# EAGLE design MAPE-CUN-Large-022-Input (EAGLE 7.3.0)
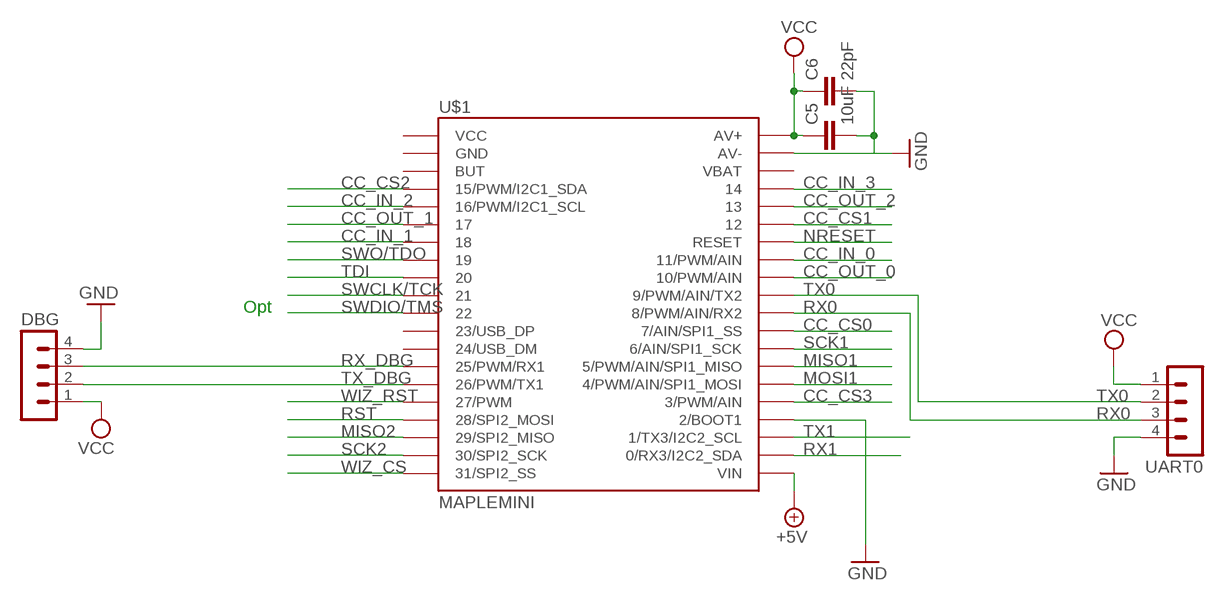
[diagram p0: schematic, sheet 1]

## Parts
C5  10uF  C-EUC1210  [C1210]
C6  22pF  C-EUC0805  [C0805]
DBG  MA04-1  [MA04-1]
U$1  MAPLEMINI  [20-DIP]
UART0  MA04-1  [MA04-1]

## Nets
+5V: U$1.21(VIN)
CC_CS0: U$1.29(7/AIN/SPI1_SS)
CC_CS1: U$1.35
CC_CS2: U$1.4(15/PWM/I2C1_SDA)
CC_CS3: U$1.25(3/PWM/AIN)
CC_IN_0: U$1.33(11/PWM/AIN)
CC_IN_1: U$1.7
CC_IN_2: U$1.5(16/PWM/I2C1_SCL)
CC_IN_3: U$1.37
CC_OUT_0: U$1.32(10/PWM/AIN)
CC_OUT_1: U$1.6
CC_OUT_2: U$1.36
GND: C5.2 C6.2 DBG.4 U$1.24(2/BOOT1) U$1.39(AV-) UART0.4
MISO1: U$1.27(5/PWM/AIN/SPI1_MISO)
MISO2: U$1.18(29/SPI2_MISO)
MOSI1: U$1.26(4/PWM/AIN/SPI1_MOSI)
NRESET: U$1.34(RESET)
RST: U$1.17(28/SPI2_MOSI)
RX0: U$1.30(8/PWM/AIN/RX2) UART0.3
RX1: U$1.22(0/RX3/I2C2_SDA)
RX_DBG: DBG.3 U$1.14(25/PWM/RX1)
SCK1: U$1.28(6/AIN/SPI1_SCK)
SCK2: U$1.19(30/SPI2_SCK)
SWCLK/TCK: U$1.10
SWDIO/TMS: U$1.11
SWO/TDO: U$1.8
TDI: U$1.9
TX0: U$1.31(9/PWM/AIN/TX2) UART0.2
TX1: U$1.23(1/TX3/I2C2_SCL)
TX_DBG: DBG.2 U$1.15(26/PWM/TX1)
VCC: C5.1 C6.1 DBG.1 U$1.40(AV+) UART0.1
WIZ_CS: U$1.20(31/SPI2_SS)
WIZ_RST: U$1.16(27/PWM)
Unconnected: U$1.1(VCC) U$1.2(GND) U$1.3(BUT) U$1.12(23/USB_DP) U$1.13(24/USB_DM) U$1.38(VBAT)

## Notes on the sheet
- Opt

## Library data of the parts
C5 C6 = rcl:C-EU: CAPACITOR, European symbol
DBG UART0 = con-lstb:MA04-1: PIN HEADER; OC_FARNELL: unknown; OC_NEWARK: unknown
U$1 = maplemini-small:MAPLEMINI

## Net classes
0 default: width 0.406 mm
1 PWR: width 0.305 mm

## Board
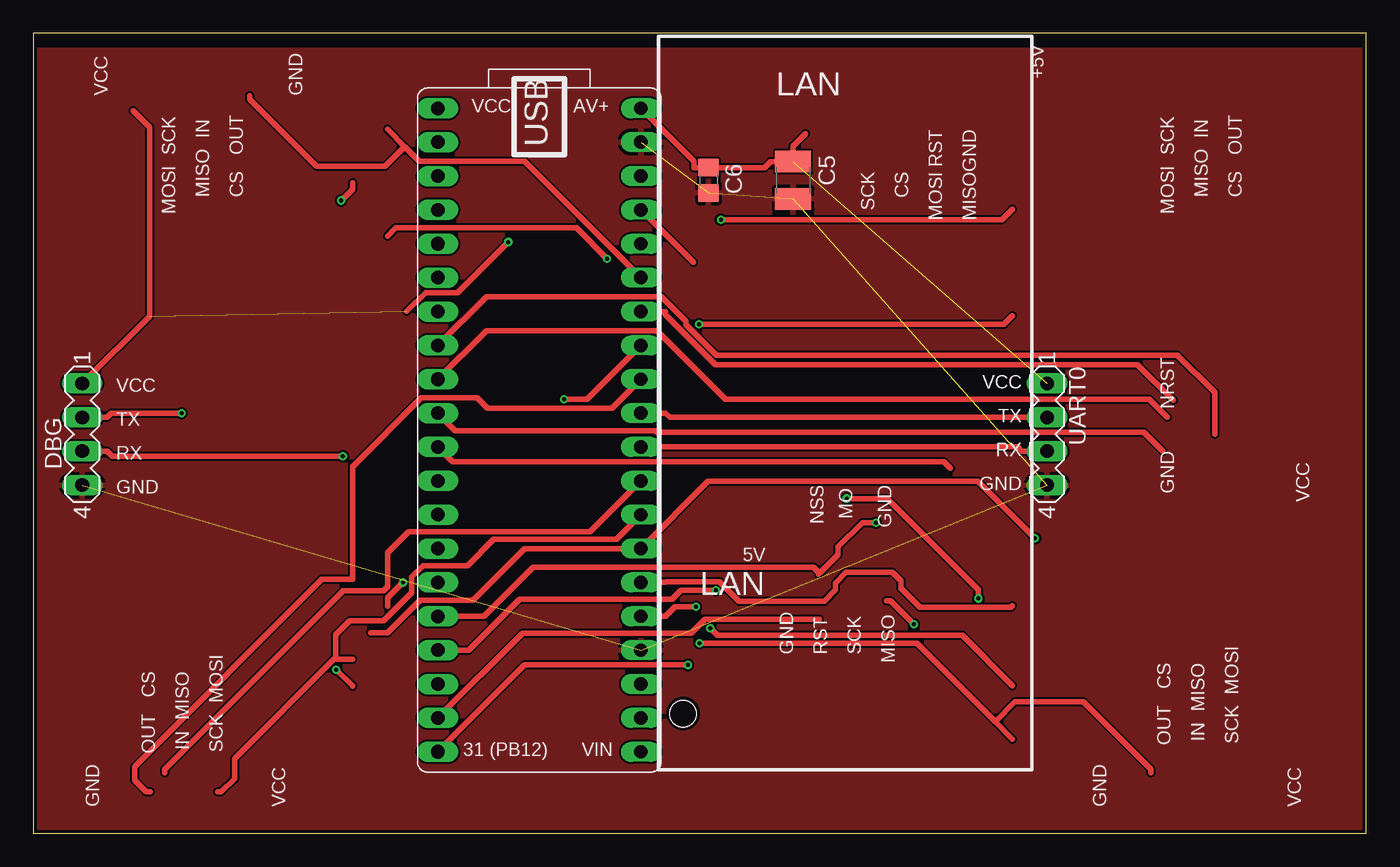
[diagram p1: board, top side]
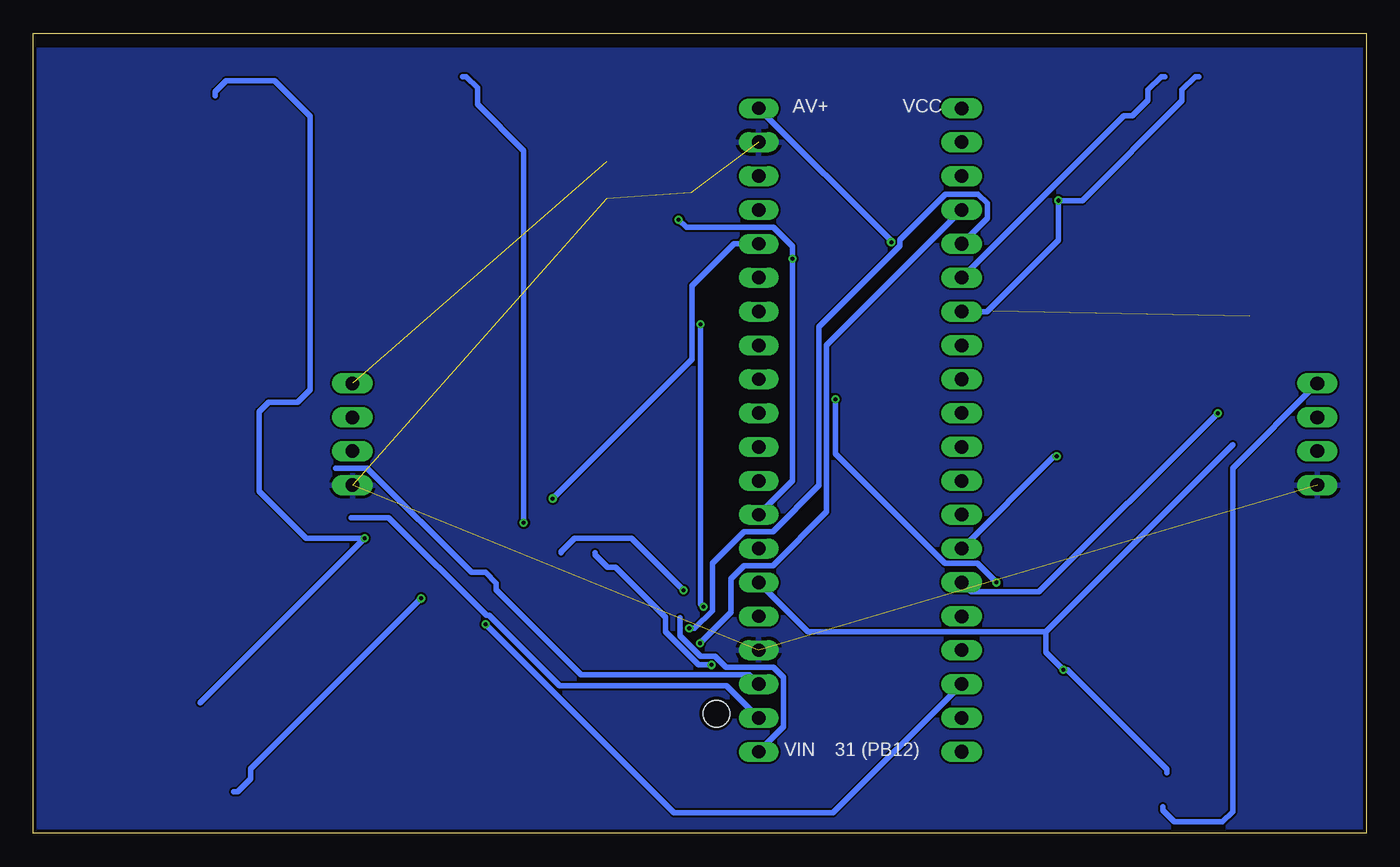
[diagram p2: board, bottom side, seen from below]

Size 100 x 60 mm. Coordinates in mm from the lower left corner, seen from the top.
Outline: 0,60 0,0 100,0 100,60 0,60
Copper layers (1*16): Top 0.035mm / dielectric 1.5mm / Bottom 0.035mm
Design rules "SeeedStudio_2layer_DRU_no_angle_20140221": minimum track width 6mil, minimum drill 12mil, track to track 6mil, track to pad 6mil, pad to pad 6mil, via to via 6mil, smd to smd 0mil, copper to edge 10mil, drill to drill 10mil, minimum pad ring 10mil, minimum via ring 6mil, stop-mask expansion 2mil, vias tented up to drill 100mil, thermal gap 10mil
Holes 2 mm at 48.76,8.97
tRestrict: area -0.1,59.1 to 100.2,59.8
bRestrict: area -0.1,59.1 to 100.2,59.8

### Footprints (pad centres in the part's own frame; a part is rotated, then mirrored left to right if it is on the bottom)
C1210 = smd 1.6 x 2.7: 1 -1.4,0; 2 1.4,0
C0805 = smd 1.3 x 1.5: 1 -0.95,0; 2 0.95,0
MA04-1 = drill 1.016 long: 1 -3.81,0; 2 -1.27,0; 3 1.27,0; 4 3.81,0
20-DIP = drill 1.016 pad 1.27 long: 1 -24.13,-7.62; 2 -21.59,-7.62; 3 -19.05,-7.62; 4 -16.51,-7.62; 5 -13.97,-7.62; 6 -11.43,-7.62; 7 -8.89,-7.62; 8 -6.35,-7.62; 9 -3.81,-7.62; 10 -1.27,-7.62; 11 1.27,-7.62; 12 3.81,-7.62; 13 6.35,-7.62; 14 8.89,-7.62; 15 11.43,-7.62; 16 13.97,-7.62; 17 16.51,-7.62; 18 19.05,-7.62; 19 21.59,-7.62; 20 24.13,-7.62 | drill 1 pad 1.27 long: 21 24.13,7.62; 22 21.59,7.62; 23 19.05,7.62; 24 16.51,7.62; 25 13.97,7.62; 26 11.43,7.62; 27 8.89,7.62; 28 6.35,7.62; 29 3.81,7.62; 30 1.27,7.62; 31 -1.27,7.62; 32 -3.81,7.62; 33 -6.35,7.62; 34 -8.89,7.62; 35 -11.43,7.62; 36 -13.97,7.62; 37 -16.51,7.62; 38 -19.05,7.62; 39 -21.59,7.62; 40 -24.13,7.62

### Placement (x,y rotation side)
C5  57.01,48.98 270 top
C6  50.66,48.98 270 top
DBG  3.67,29.93 270 top
U$1  37.96,30.25 270 top
UART0  76.06,29.93 270 top

### Tracks (layer width: path | path; a pad name or v marks a point on that pad's centre or on a via)
+5V
  Bottom 0.406: 51.48,16.15 51.48,14.83 49.95,13.29 48.84,13.29 48.02,12.47 44.46,12.47 43.71,11.71 43.71,7.99 U$1.21
CC_CS0
  Top 0.406: 9.87,4.53 9.87,4.81 23.26,18.2 26.29,18.2 26.58,18.49 26.58,21.04 28.17,22.63 41.77,22.63 U$1.29
CC_CS1
  Top 0.406: 27.86,51.51 26.58,52.79 | U$1.35 36.84,50.42 28.96,50.42 27.86,51.51 | 16.22,55.33 16.22,55.05 21.24,50.03 26.38,50.03 27.86,51.51
CC_CS2  (via drill 0.3 pad 0.61)
  Top 0.406: 72.17,8.37 73.47,7.07 | v49.98,14.26 66.28,14.26 72.17,8.37 | 83.83,4.53 83.83,4.81 78.78,9.86 73.66,9.86 72.17,8.37
  Bottom 0.406: U$1.4 40.5,36.6 40.5,24.1 44.52,20.09 46.67,20.09 47.67,19.09 47.67,16.58 v49.98,14.26
CC_CS3  (via drill 0.3 pad 0.61)
  Top 0.406: U$1.25 47.44,16.28 48.15,16.98 v49.71,16.98 | v49.93,38.18 72.83,38.18 73.47,38.82
  Bottom 0.406: v49.71,16.98 49.93,17.2 v49.93,38.18
CC_IN_0  (via drill 0.3 pad 0.61)
  Top 0.406: U$1.33 41.55,32.56 v39.83,32.56 | v27.73,18.82 26.58,17.67 26.58,17.04
  Bottom 0.406: v39.83,32.56 39.83,28.45 31.61,20.24 29.15,20.24 v27.73,18.82
CC_IN_1  (via drill 0.3 pad 0.61)
  Top 0.406: v23.1,47.46 23.94,48.3 23.94,48.79
  Bottom 0.406: 12.56,56.75 12.83,56.75 13.83,55.76 13.83,54.94 21.31,47.46 v23.1,47.46 23.1,44.5 28.46,39.14 U$1.7
CC_IN_2  (via drill 0.3 pad 0.61)
  Top 0.406: v50.79,15.38 51.32,14.85 69.69,14.85 73.47,11.07
  Bottom 0.406: U$1.5 28.43,46.13 28.43,47.25 29.12,47.94 31.55,47.94 34.97,44.52 34.97,44.07 41.06,37.99 41.06,26.09 44.52,22.63 46.7,22.63 49.05,20.27 49.05,16.71 50.38,15.38 v50.79,15.38
CC_IN_3
  Top 0.406: 49.52,42.82 U$1.37
CC_OUT_0
  Top 0.406: 8.75,3.11 8.47,3.11 7.59,3.99 7.59,5.01 21.62,19.04 23.94,19.04 23.94,27.5 29.11,32.67 33.28,32.67 34.07,31.88 43.4,31.88 U$1.32
CC_OUT_1
  Bottom 0.406: U$1.6 18.19,53.82 17.54,53.82 16.37,55 16.37,55.76 15.37,56.75 15.1,56.75
CC_OUT_2  (via drill 0.3 pad 0.61)
  Top 0.406: v70.91,17.62 70.91,18.27 64.07,25.11 v61.03,25.11
  Bottom 0.406: v61.03,25.11 50.59,35.55 50.59,41.07 47.44,44.22 U$1.36 | v70.91,17.62 83.68,4.85 83.68,4.1 84.68,3.11 84.95,3.11
GND  (5 unrouted)
  pour Bottom: -0.14,59.78 -0.14,0.08 100.19,0.08 100.19,59.78
  pour Top: -0.14,0.08 -0.14,59.78 100.19,59.78 100.19,0.08
MISO1  (via drill 0.3 pad 0.61)
  Top 0.406: 25.32,15.04 26.58,15.04 29.01,17.47 32.98,17.47 36.87,21.36 43.72,21.36 45.27,21.36 U$1.27 50.64,26.41 70.87,26.41 v75.16,22.13
  Bottom 0.406: 86.37,55.33 86.37,55.61 85.53,56.45 81.91,56.45 79.23,53.77 79.23,33.26 80.15,32.34 82.34,32.34 83.06,31.63 83.06,25.65 79.54,22.13 v75.16,22.13 87.49,9.8
MISO2  (via drill 0.3 pad 0.61)
  Top 0.406: 64,17.43 64.32,17.43 v66.06,15.69
  Bottom 0.406: v66.06,15.69 51.91,1.54 40,1.54 U$1.18
MOSI1  (via drill 0.3 pad 0.61)
  Top 0.406: v22.72,12.28 23.94,11.06 23.94,11.04 | 73.47,17.07 73.36,16.96 66.53,16.96 65.09,18.39 65.09,18.94 64.47,19.57 60.98,19.57 60.19,18.77 60.19,18.26 59.35,17.42 52.96,17.42 51.49,18.89 47.51,18.89 47.44,18.82 U$1.26
  Bottom 0.406: 24.03,15.12 10.02,29.13 | U$1.26 41.88,15.12 24.03,15.12 | 24.03,15.12 24.03,13.59 v22.72,12.28 22.42,12.28 14.95,4.8 14.95,4.53
NRESET
  Top 0.406: 85.52,32.47 82.84,35.15 51.18,35.15 47.44,38.89 47.44,39.14 U$1.34
RST  (via drill 0.3 pad 0.61)
  Top 0.406: v51.22,18.23 48.6,18.23 47.92,17.55 36.48,17.55 32.67,13.74 U$1.17
  Bottom 0.406: 60.39,21.04 60.39,21.14 59.4,22.12 55.11,22.12 v51.22,18.23
RX0
  Top 0.406: UART0.3 74.18,28.66 73.86,28.98 U$1.30
RX1
  Bottom 0.406: 76.16,23.68 73.34,23.68 66.01,16.35 65.79,16.35 60.5,11.06 47.99,11.06 U$1.22
RX_DBG  (via drill 0.3 pad 0.61)
  Top 0.406: DBG.3 5.55,28.66 5.93,28.28 v23.23,28.28
  Bottom 0.406: U$1.14 23.42,28.28 v23.23,28.28
SCK1  (via drill 0.3 pad 0.61)
  Top 0.406: 22.69,13.04 22.55,13.04 15.1,5.59 15.1,4.1 14.1,3.11 13.83,3.11 | 23.94,13.04 22.69,13.04 | U$1.28 43.75,22.07 34.55,22.07 32.57,20.09 29.23,20.09 28.39,19.25 28.39,18.04 26.29,15.94 23.74,15.94 22.69,14.88 22.69,13.04 | v51.58,46.03 72.68,46.03 73.47,46.82 | v43.05,43.09 40.74,45.4 27.19,45.4 26.58,44.79
  Bottom 0.406: v51.58,46.03 51.01,45.46 44.47,45.46 43.05,44.04 v43.05,43.09 43.05,26.43 U$1.28
SCK2
  Top 0.406: 58.99,16.04 50.38,16.04 49.36,15.02 36.7,15.02 U$1.19
SWCLK/TCK
  Top 0.406: U$1.10 31.65,30.2 46.68,30.2 46.8,30.08 83.33,30.08 84.75,28.66
SWDIO/TMS
  Top 0.406: 68.8,27.39 68.33,27.86 31.46,27.86 U$1.11
SWO/TDO
  Top 0.406: U$1.8 34,40.26 47.11,40.26 48.97,38.41 48.97,38.16 51.25,35.87 85.83,35.87 88.64,33.07 88.64,29.93
TDI
  Top 0.406: U$1.9 33.99,37.71 46.79,37.71 51.95,32.55 83.72,32.55 85.07,31.2
TX0
  Top 0.406: U$1.31 47.44,31.52 47.76,31.2 UART0.2
TX1
  Bottom 0.406: U$1.23 46.27,11.88 58.89,11.88 65.27,18.26 65.27,18.77 66.06,19.57 67.12,19.57 74.94,27.39 77.33,27.39
TX_DBG  (via drill 0.3 pad 0.61)
  Top 0.406: DBG.2 5.55,31.2 5.86,31.5 v11.13,31.5
  Bottom 0.406: U$1.15 29.62,18.1 24.54,18.1 v11.13,31.5
VCC  (via drill 0.3 pad 0.61)  (2 unrouted)
  Top 0.406: v35.63,44.35 31.85,40.56 29.42,40.56 28,39.14 | U$1.40 49.55,50.4 49.55,49.93 C6.1 54.85,49.93 55.3,50.38 C5.1 57.01,51.54 57.94,52.47 | DBG.1 8.72,38.79 8.72,52.97 7.48,54.21
  Bottom 0.406: U$1.40 35.63,44.43 v35.63,44.35 | DBG.1 10.02,27.39 10.02,1.61 10.78,0.85 14.39,0.85 15.25,1.72 15.25,1.99
WIZ_CS  (via drill 0.3 pad 0.61)
  Top 0.406: v49.12,12.63 36.85,12.63 U$1.20
  Bottom 0.406: 57.85,21.04 57.85,20.91 56.91,19.97 56.33,19.97 52.57,16.21 52.57,15.11 50.09,12.63 v49.12,12.63
WIZ_RST  (via drill 0.3 pad 0.61)
  Top 0.406: 58.91,19.57 58.52,19.96 37.49,19.96 33.81,16.28 U$1.16 | 58.91,19.43 58.91,19.57 | v63.21,23.29 62.2,23.29 60.38,21.48 60.38,20.9 59.05,19.57 58.91,19.57
  Bottom 0.406: 67.8,56.75 67.53,56.75 66.69,55.91 66.69,54.69 63.21,51.21 v63.21,23.29

### Text on the board
tNames: +5V | VCC | GND | LAN | VCC | AV+ | IN | RST | GND | IN | USB | SCK | OUT | SCK | OUT | SCK | CS | MOSI | MISO | MISO | CS | MISO | CS | MOSI | MOSI | VCC | VCC | TX | NRST | TX | RX | RX | NSS | GND | GND | GND | GND | VCC | MO | 5V | LAN | MOSI | MOSI | GND | RST | SCK | CS | MISO | MISO | CS | MISO | OUT | SCK | OUT | SCK | IN | IN | 31 (PB12) | VIN | GND | VCC | GND | VCC
bNames: VCC | AV+ | 31 (PB12) | VIN